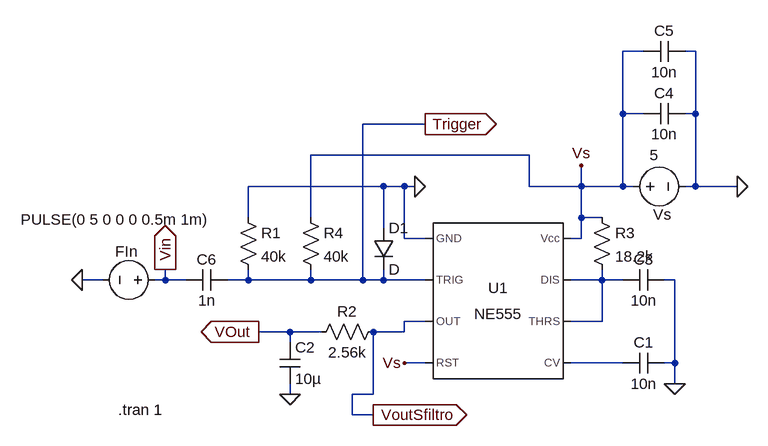
[diagram p0: schematic 555_cft.asc]
555_cft.asc, the LTspice schematic file:
Version 4
SHEET 1 880 680
WIRE 416 -208 384 -208
WIRE 496 -208 480 -208
WIRE 384 -112 384 -208
WIRE 416 -112 384 -112
WIRE 496 -112 496 -208
WIRE 496 -112 480 -112
WIRE 80 -96 -16 -96
WIRE 240 -48 -96 -48
WIRE 16 0 -192 0
WIRE 48 0 16 0
WIRE 64 0 48 0
WIRE 240 0 240 -48
WIRE 320 0 320 -32
WIRE 320 0 240 0
WIRE 384 0 384 -112
WIRE 384 0 320 0
WIRE 400 0 384 0
WIRE 496 0 496 -112
WIRE 496 0 480 0
WIRE 560 0 496 0
WIRE -192 48 -192 0
WIRE -96 48 -96 -48
WIRE 320 48 320 0
WIRE 352 48 320 48
WIRE 16 64 16 0
WIRE 48 80 48 0
WIRE 80 80 48 80
WIRE 320 80 320 48
WIRE 320 80 304 80
WIRE -416 144 -448 144
WIRE -320 144 -320 128
WIRE -320 144 -336 144
WIRE -288 144 -320 144
WIRE -192 144 -192 128
WIRE -192 144 -224 144
WIRE -96 144 -96 128
WIRE -96 144 -192 144
WIRE -16 144 -16 -96
WIRE -16 144 -96 144
WIRE 16 144 16 128
WIRE 16 144 -16 144
WIRE 80 144 16 144
WIRE 352 144 352 128
WIRE 352 144 304 144
WIRE 384 144 352 144
WIRE 464 144 448 144
WIRE 80 208 48 208
WIRE 352 208 352 144
WIRE 352 208 304 208
WIRE -128 224 -176 224
WIRE -80 224 -128 224
WIRE 48 224 48 208
WIRE 48 224 0 224
WIRE -128 240 -128 224
WIRE 80 272 48 272
WIRE 384 272 304 272
WIRE 464 272 464 144
WIRE 464 272 448 272
WIRE 464 304 464 272
WIRE -128 320 -128 304
WIRE 0 320 0 224
WIRE 0 320 -32 320
WIRE -32 352 -32 320
WIRE 0 352 -32 352
FLAG 464 304 0
FLAG 64 0 0
FLAG -128 320 0
FLAG -448 144 0
FLAG 560 0 0
FLAG 320 -32 Vs
FLAG 48 272 Vs
FLAG -176 224 VOut
IOPIN -176 224 Out
FLAG -320 128 Vin
IOPIN -320 128 Out
FLAG 0 352 VoutSfiltro
IOPIN 0 352 Out
FLAG 80 -96 Trigger
IOPIN 80 -96 Out
SYMBOL Misc\\NE555 192 176 R0
SYMATTR InstName U1
SYMBOL cap 448 256 R90
WINDOW 0 0 32 VBottom 2
WINDOW 3 32 32 VTop 2
SYMATTR InstName C1
SYMATTR Value 10n
SYMBOL diode 0 64 R0
SYMATTR InstName D1
SYMBOL res 16 208 R90
WINDOW 0 0 56 VBottom 2
WINDOW 3 32 56 VTop 2
SYMATTR InstName R2
SYMATTR Value 2.56k
SYMBOL cap -144 240 R0
SYMATTR InstName C2
SYMATTR Value 10µ
SYMBOL cap 448 128 R90
WINDOW 0 0 32 VBottom 2
WINDOW 3 32 32 VTop 2
SYMATTR InstName C3
SYMATTR Value 10n
SYMBOL res 336 32 R0
SYMATTR InstName R3
SYMATTR Value 18.2k
SYMBOL voltage -320 144 R90
WINDOW 123 0 0 Left 2
WINDOW 39 0 0 Left 2
WINDOW 0 -44 42 VRight 2
WINDOW 3 -93 -68 VRight 2
SYMATTR InstName FIn
SYMATTR Value PULSE(0 5 0 0 0 0.5m 1m)
SYMBOL voltage 384 0 R270
WINDOW 123 0 0 Left 2
WINDOW 39 0 0 Left 2
WINDOW 0 -43 47 VRight 2
WINDOW 3 48 41 VRight 2
SYMATTR InstName Vs
SYMATTR Value 5
SYMBOL cap 480 -128 R90
WINDOW 0 0 32 VBottom 2
WINDOW 3 32 32 VTop 2
SYMATTR InstName C4
SYMATTR Value 10n
SYMBOL cap 480 -224 R90
WINDOW 0 0 32 VBottom 2
WINDOW 3 32 32 VTop 2
SYMATTR InstName C5
SYMATTR Value 10n
SYMBOL cap -224 128 R90
WINDOW 0 0 32 VBottom 2
WINDOW 3 32 32 VTop 2
SYMATTR InstName C6
SYMATTR Value 1n
SYMBOL res -208 32 R0
SYMATTR InstName R1
SYMATTR Value 40k
SYMBOL res -112 32 R0
SYMATTR InstName R4
SYMATTR Value 40k
TEXT -392 344 Left 2 !.tran 1

The netlist it stands for:
* 555_cft.asc
XU1 0 Trigger VoutSfiltro Vs N002 N001 N001 Vs NE555  ; pins GND TRIG OUT RST CV THRS DIS Vcc
C1 0 N002 10n
D1 0 Trigger D
R2 VoutSfiltro VOut 2.56k
C2 VOut 0 10µ
C3 0 N001 10n
R3 Vs N001 18.2k
V§FIn Vin 0 PULSE(0 5 0 0 0 0.5m 1m)
Vs Vs 0 5
C4 0 Vs 10n
C5 0 Vs 10n
C6 Trigger Vin 1n
R1 0 Trigger 40k
R4 Vs Trigger 40k
.model D D
.lib standard.dio
.tran 1
.lib NE555.sub
.backanno
.end